# EAGLE schematic DragonBall (EAGLE 9.6.2)
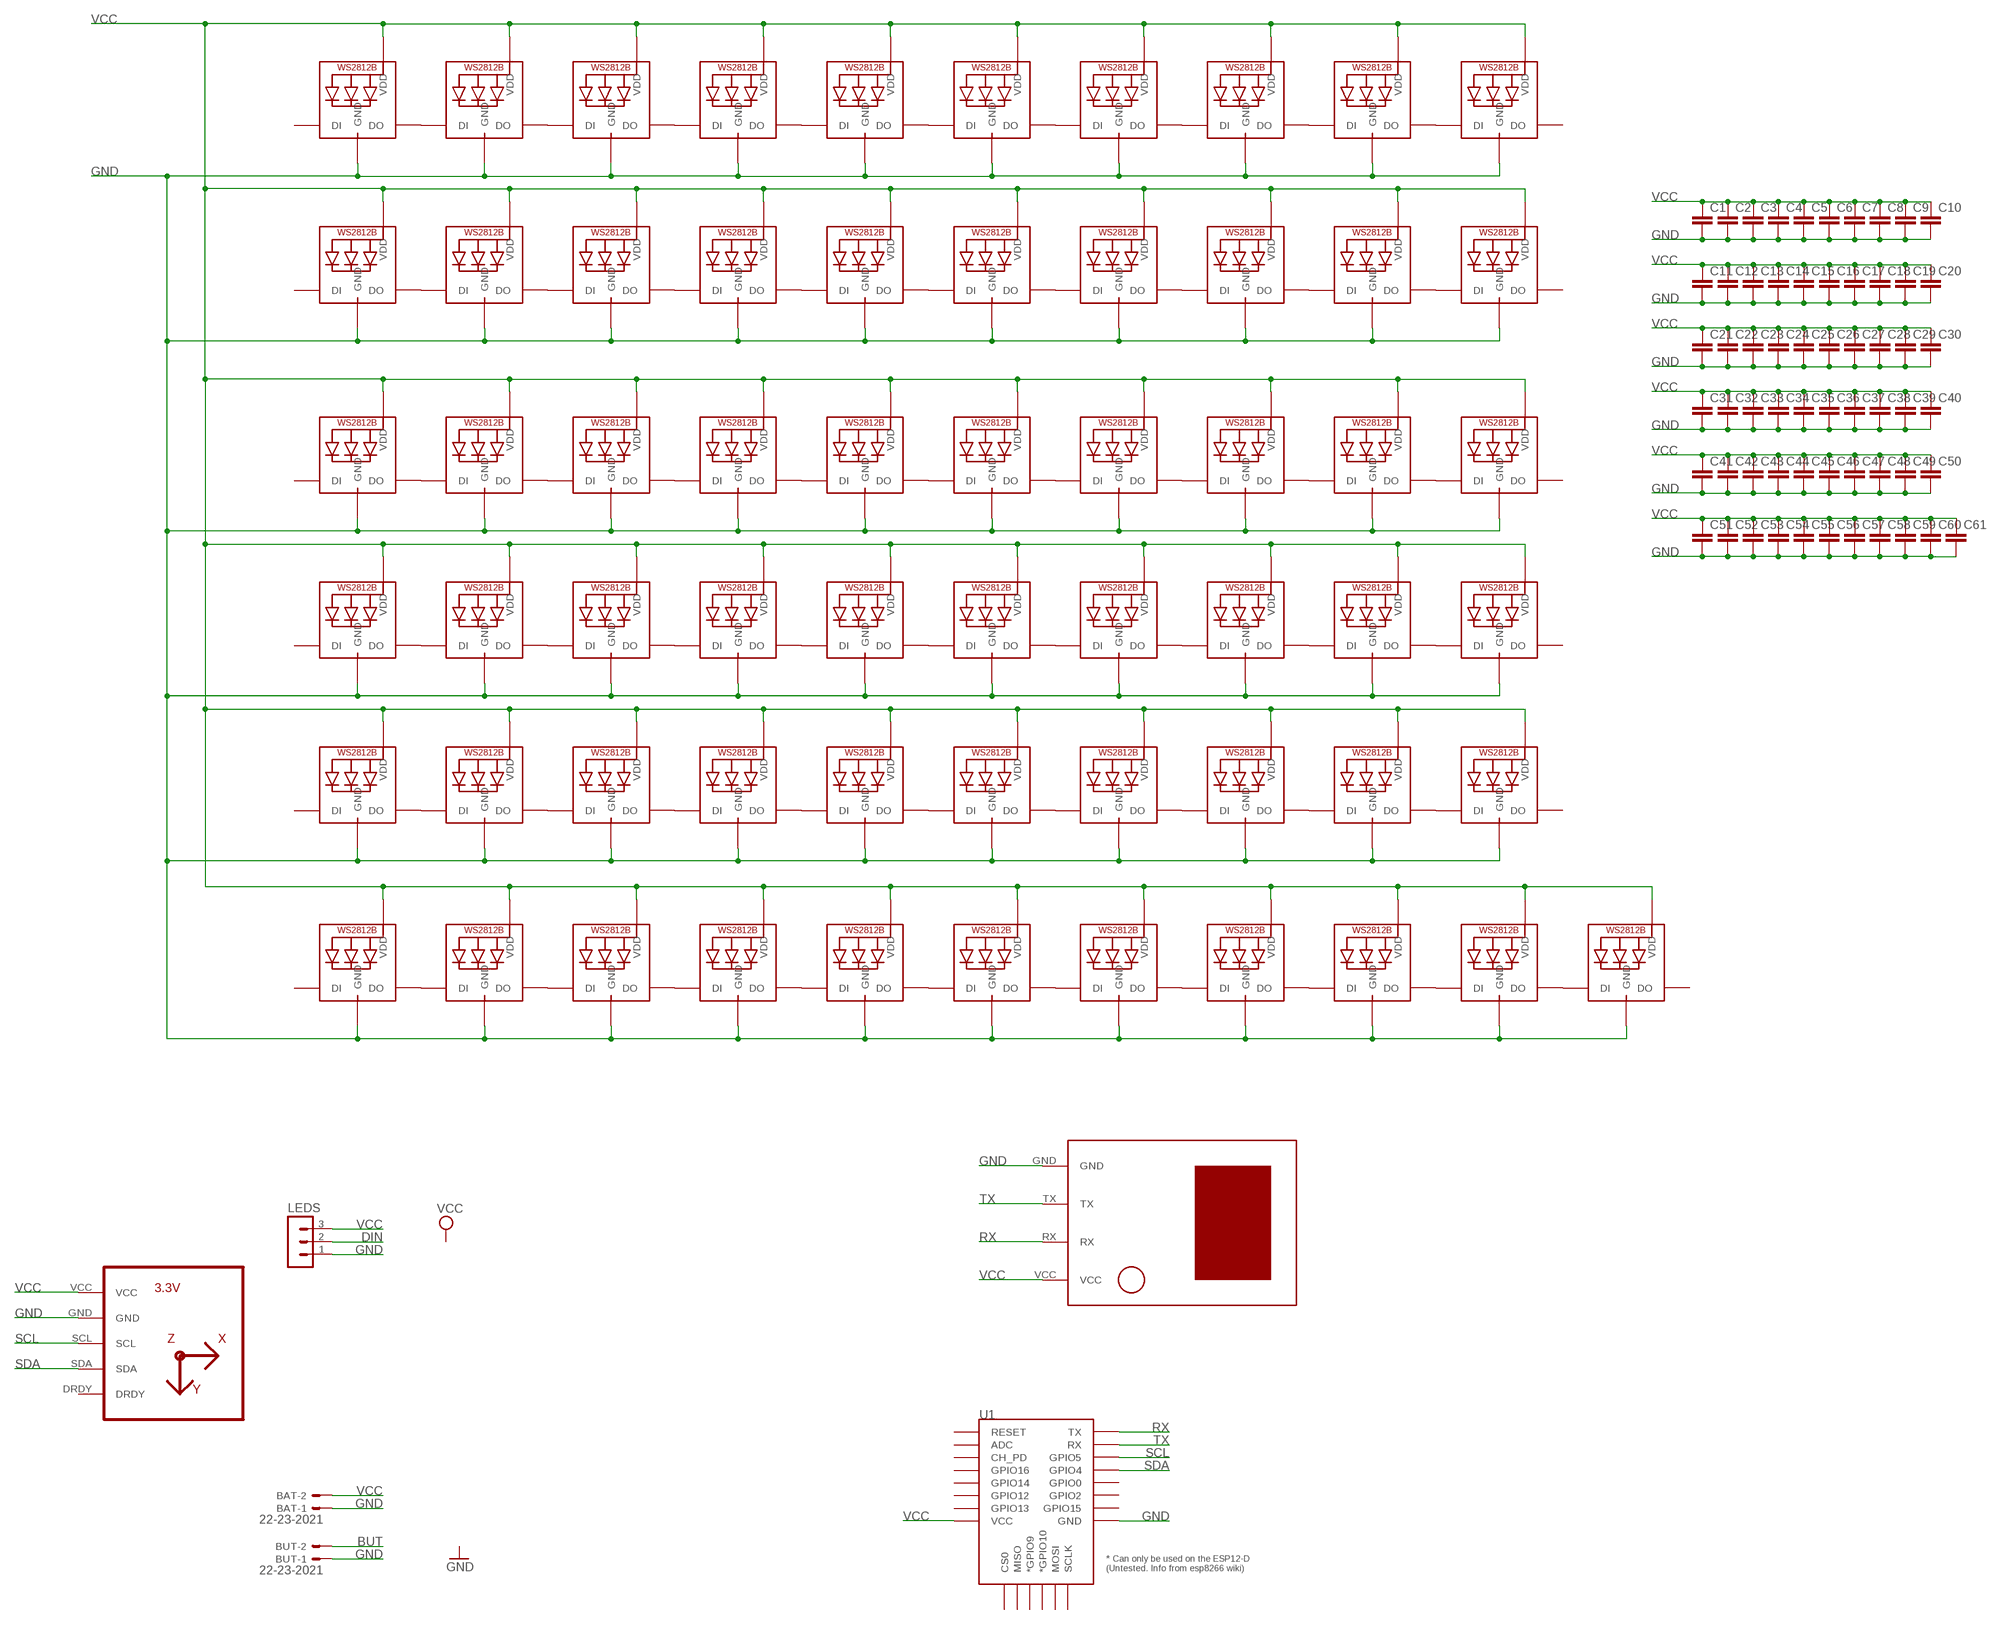
[diagram p0: schematic, sheet 1]

## Parts
BAT  22-23-2021  [22-23-2021]
BUT  22-23-2021  [22-23-2021]
C1  C-EUC0402K  [C0402K]
C2  C-EUC0402K  [C0402K]
C3  C-EUC0402K  [C0402K]
C4  C-EUC0402K  [C0402K]
C5  C-EUC0402K  [C0402K]
C6  C-EUC0402K  [C0402K]
C7  C-EUC0402K  [C0402K]
C8  C-EUC0402K  [C0402K]
C9  C-EUC0402K  [C0402K]
C10  C-EUC0402K  [C0402K]
C11  C-EUC0402K  [C0402K]
C12  C-EUC0402K  [C0402K]
C13  C-EUC0402K  [C0402K]
C14  C-EUC0402K  [C0402K]
C15  C-EUC0402K  [C0402K]
C16  C-EUC0402K  [C0402K]
C17  C-EUC0402K  [C0402K]
C18  C-EUC0402K  [C0402K]
C19  C-EUC0402K  [C0402K]
C20  C-EUC0402K  [C0402K]
C21  C-EUC0402K  [C0402K]
C22  C-EUC0402K  [C0402K]
C23  C-EUC0402K  [C0402K]
C24  C-EUC0402K  [C0402K]
C25  C-EUC0402K  [C0402K]
C26  C-EUC0402K  [C0402K]
C27  C-EUC0402K  [C0402K]
C28  C-EUC0402K  [C0402K]
C29  C-EUC0402K  [C0402K]
C30  C-EUC0402K  [C0402K]
C31  C-EUC0402K  [C0402K]
C32  C-EUC0402K  [C0402K]
C33  C-EUC0402K  [C0402K]
C34  C-EUC0402K  [C0402K]
C35  C-EUC0402K  [C0402K]
C36  C-EUC0402K  [C0402K]
C37  C-EUC0402K  [C0402K]
C38  C-EUC0402K  [C0402K]
C39  C-EUC0402K  [C0402K]
C40  C-EUC0402K  [C0402K]
C41  C-EUC0402K  [C0402K]
C42  C-EUC0402K  [C0402K]
C43  C-EUC0402K  [C0402K]
C44  C-EUC0402K  [C0402K]
C45  C-EUC0402K  [C0402K]
C46  C-EUC0402K  [C0402K]
C47  C-EUC0402K  [C0402K]
C48  C-EUC0402K  [C0402K]
C49  C-EUC0402K  [C0402K]
C50  C-EUC0402K  [C0402K]
C51  C-EUC0402K  [C0402K]
C52  C-EUC0402K  [C0402K]
C53  C-EUC0402K  [C0402K]
C54  C-EUC0402K  [C0402K]
C55  C-EUC0402K  [C0402K]
C56  C-EUC0402K  [C0402K]
C57  C-EUC0402K  [C0402K]
C58  C-EUC0402K  [C0402K]
C59  C-EUC0402K  [C0402K]
C60  C-EUC0402K  [C0402K]
C61  C-EUC0402K  [C0402K]
GYRO  HMC5883LGY-271  [GY-271]
LED1  WS2812B_5050N  [WS2812B-NARROW]
LED2  WS2812B_5050N  [WS2812B-NARROW]
LED3  WS2812B_5050N  [WS2812B-NARROW]
LED4  WS2812B_5050N  [WS2812B-NARROW]
LED5  WS2812B_5050N  [WS2812B-NARROW]
LED6  WS2812B_5050N  [WS2812B-NARROW]
LED7  WS2812B_5050N  [WS2812B-NARROW]
LED8  WS2812B_5050N  [WS2812B-NARROW]
LED9  WS2812B_5050N  [WS2812B-NARROW]
LED10  WS2812B_5050N  [WS2812B-NARROW]
LED11  WS2812B_5050N  [WS2812B-NARROW]
LED12  WS2812B_5050N  [WS2812B-NARROW]
LED13  WS2812B_5050N  [WS2812B-NARROW]
LED14  WS2812B_5050N  [WS2812B-NARROW]
LED15  WS2812B_5050N  [WS2812B-NARROW]
LED16  WS2812B_5050N  [WS2812B-NARROW]
LED17  WS2812B_5050N  [WS2812B-NARROW]
LED18  WS2812B_5050N  [WS2812B-NARROW]
LED19  WS2812B_5050N  [WS2812B-NARROW]
LED20  WS2812B_5050N  [WS2812B-NARROW]
LED21  WS2812B_5050N  [WS2812B-NARROW]
LED22  WS2812B_5050N  [WS2812B-NARROW]
LED23  WS2812B_5050N  [WS2812B-NARROW]
LED24  WS2812B_5050N  [WS2812B-NARROW]
LED25  WS2812B_5050N  [WS2812B-NARROW]
LED26  WS2812B_5050N  [WS2812B-NARROW]
LED27  WS2812B_5050N  [WS2812B-NARROW]
LED28  WS2812B_5050N  [WS2812B-NARROW]
LED29  WS2812B_5050N  [WS2812B-NARROW]
LED30  WS2812B_5050N  [WS2812B-NARROW]
LED31  WS2812B_5050N  [WS2812B-NARROW]
LED32  WS2812B_5050N  [WS2812B-NARROW]
LED33  WS2812B_5050N  [WS2812B-NARROW]
LED34  WS2812B_5050N  [WS2812B-NARROW]
LED35  WS2812B_5050N  [WS2812B-NARROW]
LED36  WS2812B_5050N  [WS2812B-NARROW]
LED37  WS2812B_5050N  [WS2812B-NARROW]
LED38  WS2812B_5050N  [WS2812B-NARROW]
LED39  WS2812B_5050N  [WS2812B-NARROW]
LED40  WS2812B_5050N  [WS2812B-NARROW]
LED41  WS2812B_5050N  [WS2812B-NARROW]
LED42  WS2812B_5050N  [WS2812B-NARROW]
LED43  WS2812B_5050N  [WS2812B-NARROW]
LED44  WS2812B_5050N  [WS2812B-NARROW]
LED45  WS2812B_5050N  [WS2812B-NARROW]
LED46  WS2812B_5050N  [WS2812B-NARROW]
LED47  WS2812B_5050N  [WS2812B-NARROW]
LED48  WS2812B_5050N  [WS2812B-NARROW]
LED49  WS2812B_5050N  [WS2812B-NARROW]
LED50  WS2812B_5050N  [WS2812B-NARROW]
LED51  WS2812B_5050N  [WS2812B-NARROW]
LED52  WS2812B_5050N  [WS2812B-NARROW]
LED53  WS2812B_5050N  [WS2812B-NARROW]
LED54  WS2812B_5050N  [WS2812B-NARROW]
LED55  WS2812B_5050N  [WS2812B-NARROW]
LED56  WS2812B_5050N  [WS2812B-NARROW]
LED57  WS2812B_5050N  [WS2812B-NARROW]
LED58  WS2812B_5050N  [WS2812B-NARROW]
LED59  WS2812B_5050N  [WS2812B-NARROW]
LED60  WS2812B_5050N  [WS2812B-NARROW]
LED61  WS2812B_5050N  [WS2812B-NARROW]
LEDS  MA03-1  [MA03-1]
U1  ESP12ESMD  [ESP12E-SMD]
U$3  U-BLOX-NEO6V2  [U-BLOX-NEO6V2]

## Nets
BUT: BUT.2
DIN: LEDS.2
GND: BAT.1 BUT.1 C1.2 C2.2 C3.2 C4.2 C5.2 C6.2 C7.2 C8.2 C9.2 C10.2 C11.2 C12.2 C13.2 C14.2 C15.2 C16.2 C17.2 C18.2 C19.2 C20.2 C21.2 C22.2 C23.2 C24.2 C25.2 C26.2 C27.2 C28.2 C29.2 C30.2 C31.2 C32.2 C33.2 C34.2 C35.2 C36.2 C37.2 C38.2 C39.2 C40.2 C41.2 C42.2 C43.2 C44.2 C45.2 C46.2 C47.2 C48.2 C49.2 C50.2 C51.2 C52.2 C53.2 C54.2 C55.2 C56.2 C57.2 C58.2 C59.2 C60.2 C61.2 GYRO.GND LED1.3-GND(GND) LED2.3-GND(GND) LED3.3-GND(GND) LED4.3-GND(GND) LED5.3-GND(GND) LED6.3-GND(GND) LED7.3-GND(GND) LED8.3-GND(GND) LED9.3-GND(GND) LED10.3-GND(GND) LED11.3-GND(GND) LED12.3-GND(GND) LED13.3-GND(GND) LED14.3-GND(GND) LED15.3-GND(GND) LED16.3-GND(GND) LED17.3-GND(GND) LED18.3-GND(GND) LED19.3-GND(GND) LED20.3-GND(GND) LED21.3-GND(GND) LED22.3-GND(GND) LED23.3-GND(GND) LED24.3-GND(GND) LED25.3-GND(GND) LED26.3-GND(GND) LED27.3-GND(GND) LED28.3-GND(GND) LED29.3-GND(GND) LED30.3-GND(GND) LED31.3-GND(GND) LED32.3-GND(GND) LED33.3-GND(GND) LED34.3-GND(GND) LED35.3-GND(GND) LED36.3-GND(GND) LED37.3-GND(GND) LED38.3-GND(GND) LED39.3-GND(GND) LED40.3-GND(GND) LED41.3-GND(GND) LED42.3-GND(GND) LED43.3-GND(GND) LED44.3-GND(GND) LED45.3-GND(GND) LED46.3-GND(GND) LED47.3-GND(GND) LED48.3-GND(GND) LED49.3-GND(GND) LED50.3-GND(GND) LED51.3-GND(GND) LED52.3-GND(GND) LED53.3-GND(GND) LED54.3-GND(GND) LED55.3-GND(GND) LED56.3-GND(GND) LED57.3-GND(GND) LED58.3-GND(GND) LED59.3-GND(GND) LED60.3-GND(GND) LED61.3-GND(GND) LEDS.1 U1.GND U$3.GND
N$1: LED1.2-DOUT(DO) LED2.4-DIN(DI)
N$2: LED2.2-DOUT(DO) LED3.4-DIN(DI)
N$3: LED3.2-DOUT(DO) LED4.4-DIN(DI)
N$4: LED4.2-DOUT(DO) LED5.4-DIN(DI)
N$5: LED5.2-DOUT(DO) LED6.4-DIN(DI)
N$6: LED6.2-DOUT(DO) LED7.4-DIN(DI)
N$7: LED7.2-DOUT(DO) LED8.4-DIN(DI)
N$8: LED8.2-DOUT(DO) LED9.4-DIN(DI)
N$9: LED9.2-DOUT(DO) LED10.4-DIN(DI)
N$10: LED11.2-DOUT(DO) LED12.4-DIN(DI)
N$11: LED12.2-DOUT(DO) LED13.4-DIN(DI)
N$12: LED13.2-DOUT(DO) LED14.4-DIN(DI)
N$13: LED14.2-DOUT(DO) LED15.4-DIN(DI)
N$14: LED15.2-DOUT(DO) LED16.4-DIN(DI)
N$15: LED16.2-DOUT(DO) LED17.4-DIN(DI)
N$16: LED17.2-DOUT(DO) LED18.4-DIN(DI)
N$17: LED18.2-DOUT(DO) LED19.4-DIN(DI)
N$18: LED19.2-DOUT(DO) LED20.4-DIN(DI)
N$19: LED21.2-DOUT(DO) LED22.4-DIN(DI)
N$20: LED22.2-DOUT(DO) LED23.4-DIN(DI)
N$21: LED23.2-DOUT(DO) LED24.4-DIN(DI)
N$22: LED24.2-DOUT(DO) LED25.4-DIN(DI)
N$23: LED25.2-DOUT(DO) LED26.4-DIN(DI)
N$24: LED26.2-DOUT(DO) LED27.4-DIN(DI)
N$25: LED27.2-DOUT(DO) LED28.4-DIN(DI)
N$26: LED28.2-DOUT(DO) LED29.4-DIN(DI)
N$27: LED29.2-DOUT(DO) LED30.4-DIN(DI)
N$28: LED31.2-DOUT(DO) LED32.4-DIN(DI)
N$29: LED32.2-DOUT(DO) LED33.4-DIN(DI)
N$30: LED33.2-DOUT(DO) LED34.4-DIN(DI)
N$31: LED34.2-DOUT(DO) LED35.4-DIN(DI)
N$32: LED35.2-DOUT(DO) LED36.4-DIN(DI)
N$33: LED36.2-DOUT(DO) LED37.4-DIN(DI)
N$34: LED37.2-DOUT(DO) LED38.4-DIN(DI)
N$35: LED38.2-DOUT(DO) LED39.4-DIN(DI)
N$36: LED39.2-DOUT(DO) LED40.4-DIN(DI)
N$37: LED41.2-DOUT(DO) LED42.4-DIN(DI)
N$38: LED42.2-DOUT(DO) LED43.4-DIN(DI)
N$39: LED43.2-DOUT(DO) LED44.4-DIN(DI)
N$40: LED44.2-DOUT(DO) LED45.4-DIN(DI)
N$41: LED45.2-DOUT(DO) LED46.4-DIN(DI)
N$42: LED46.2-DOUT(DO) LED47.4-DIN(DI)
N$43: LED47.2-DOUT(DO) LED48.4-DIN(DI)
N$44: LED48.2-DOUT(DO) LED49.4-DIN(DI)
N$45: LED49.2-DOUT(DO) LED50.4-DIN(DI)
N$46: LED51.2-DOUT(DO) LED52.4-DIN(DI)
N$47: LED52.2-DOUT(DO) LED53.4-DIN(DI)
N$48: LED53.2-DOUT(DO) LED54.4-DIN(DI)
N$49: LED54.2-DOUT(DO) LED55.4-DIN(DI)
N$50: LED55.2-DOUT(DO) LED56.4-DIN(DI)
N$51: LED56.2-DOUT(DO) LED57.4-DIN(DI)
N$52: LED57.2-DOUT(DO) LED58.4-DIN(DI)
N$53: LED58.2-DOUT(DO) LED59.4-DIN(DI)
N$54: LED59.2-DOUT(DO) LED60.4-DIN(DI)
N$77: LED60.2-DOUT(DO) LED61.4-DIN(DI)
RX: U1.TXD0(TX) U$3.RX
SCL: GYRO.SCL U1.GPIO5
SDA: GYRO.SDA U1.GPIO4
TX: U1.RXD0(RX) U$3.TX
VCC: BAT.2 C1.1 C2.1 C3.1 C4.1 C5.1 C6.1 C7.1 C8.1 C9.1 C10.1 C11.1 C12.1 C13.1 C14.1 C15.1 C16.1 C17.1 C18.1 C19.1 C20.1 C21.1 C22.1 C23.1 C24.1 C25.1 C26.1 C27.1 C28.1 C29.1 C30.1 C31.1 C32.1 C33.1 C34.1 C35.1 C36.1 C37.1 C38.1 C39.1 C40.1 C41.1 C42.1 C43.1 C44.1 C45.1 C46.1 C47.1 C48.1 C49.1 C50.1 C51.1 C52.1 C53.1 C54.1 C55.1 C56.1 C57.1 C58.1 C59.1 C60.1 C61.1 GYRO.VCC LED1.1-VDD(VDD) LED2.1-VDD(VDD) LED3.1-VDD(VDD) LED4.1-VDD(VDD) LED5.1-VDD(VDD) LED6.1-VDD(VDD) LED7.1-VDD(VDD) LED8.1-VDD(VDD) LED9.1-VDD(VDD) LED10.1-VDD(VDD) LED11.1-VDD(VDD) LED12.1-VDD(VDD) LED13.1-VDD(VDD) LED14.1-VDD(VDD) LED15.1-VDD(VDD) LED16.1-VDD(VDD) LED17.1-VDD(VDD) LED18.1-VDD(VDD) LED19.1-VDD(VDD) LED20.1-VDD(VDD) LED21.1-VDD(VDD) LED22.1-VDD(VDD) LED23.1-VDD(VDD) LED24.1-VDD(VDD) LED25.1-VDD(VDD) LED26.1-VDD(VDD) LED27.1-VDD(VDD) LED28.1-VDD(VDD) LED29.1-VDD(VDD) LED30.1-VDD(VDD) LED31.1-VDD(VDD) LED32.1-VDD(VDD) LED33.1-VDD(VDD) LED34.1-VDD(VDD) LED35.1-VDD(VDD) LED36.1-VDD(VDD) LED37.1-VDD(VDD) LED38.1-VDD(VDD) LED39.1-VDD(VDD) LED40.1-VDD(VDD) LED41.1-VDD(VDD) LED42.1-VDD(VDD) LED43.1-VDD(VDD) LED44.1-VDD(VDD) LED45.1-VDD(VDD) LED46.1-VDD(VDD) LED47.1-VDD(VDD) LED48.1-VDD(VDD) LED49.1-VDD(VDD) LED50.1-VDD(VDD) LED51.1-VDD(VDD) LED52.1-VDD(VDD) LED53.1-VDD(VDD) LED54.1-VDD(VDD) LED55.1-VDD(VDD) LED56.1-VDD(VDD) LED57.1-VDD(VDD) LED58.1-VDD(VDD) LED59.1-VDD(VDD) LED60.1-VDD(VDD) LED61.1-VDD(VDD) LEDS.3 U1.VCC U$3.VCC
Unconnected: GYRO.DRDY LED1.4-DIN(DI) LED10.2-DOUT(DO) LED11.4-DIN(DI) LED20.2-DOUT(DO) LED21.4-DIN(DI) LED30.2-DOUT(DO) LED31.4-DIN(DI) LED40.2-DOUT(DO) LED41.4-DIN(DI) LED50.2-DOUT(DO) LED51.4-DIN(DI) LED61.2-DOUT(DO) U1.ADC U1.CH_PD U1.CS0 U1.GPIO0 U1.GPIO2 U1.GPIO9(*GPIO9) U1.GPIO10(*GPIO10) U1.GPIO12 U1.GPIO13 U1.GPIO14 U1.GPIO15 U1.GPIO16 U1.MISO U1.MOSI U1.RESET U1.SCLK

## Library data of the parts
BAT BUT = con-molex:22-23-2021: .100" (2.54mm) Center Header - 2 Pin; MF: MOLEX; MPN: 22-23-2021; OC_FARNELL: 1462926; OC_NEWARK: 25C3832
C1-C61 = rcl:C-EU: CAPACITOR, European symbol; SPICEPREFIX: C
GYRO = hmc5883l:HMC5883L
LED1-LED61 = adafruit:WS2812B
LEDS = con-lstb:MA03-1: PIN HEADER; OC_FARNELL: unknown; OC_NEWARK: unknown
U1 = esp8266modules:ESP12E: ESP12E Module
U$3 = u-blox:U-BLOX-NEO6V2